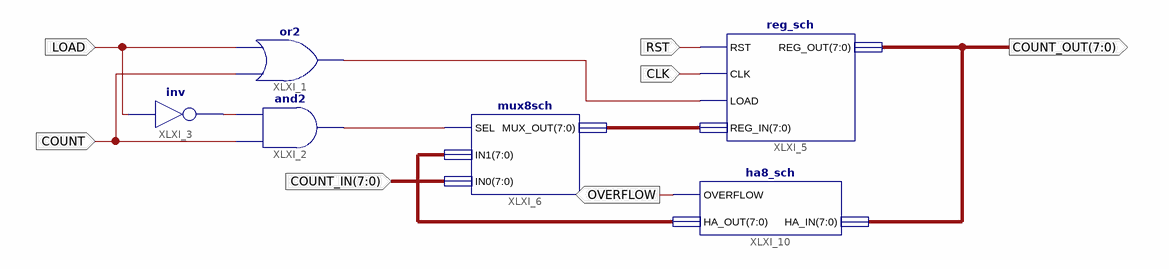
[diagram p0: schematic sheet 1]
// Xilinx ISE schematic counter_sch.sch (spartan3e) as structural Verilog: 6 symbols, 7 ports
module counter_sch (
  input  RST,
  input  CLK,
  input  [7:0] COUNT_IN,
  input  COUNT,
  input  LOAD,
  output [7:0] COUNT_OUT,
  output OVERFLOW
);

  wire XLXN_1, XLXN_8, XLXN_15;
  wire [7:0] XLXN_7, XLXN_52;

  reg_sch XLXI_5 (.RST(RST), .CLK(CLK), .LOAD(XLXN_15), .REG_IN(XLXN_7), .REG_OUT(COUNT_OUT));
  or XLXI_1 (XLXN_15, COUNT, LOAD);
  and XLXI_2 (XLXN_8, COUNT, XLXN_1);
  not XLXI_3 (XLXN_1, LOAD);
  mux8sch XLXI_6 (.SEL(XLXN_8), .IN1(XLXN_52), .IN0(COUNT_IN), .MUX_OUT(XLXN_7));
  ha8_sch XLXI_10 (.HA_IN(COUNT_OUT), .HA_OUT(XLXN_52), .OVERFLOW(OVERFLOW));
endmodule
